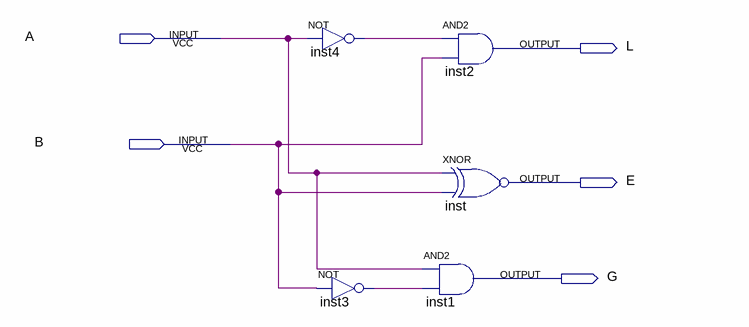
[diagram p0: schematic sheet]
// Quartus schematic comp_1bit.bdf as structural Verilog: 5 symbols, 5 pins
module comp_1bit (
  input  A,
  input  B,
  output L,
  output E,
  output G
);

  wire inst3_out, inst4_out;

  not inst4 (inst4_out, A);
  not inst3 (inst3_out, B);
  and inst2 (L, inst4_out, B);
  xnor inst (E, A, B);
  and inst1 (G, A, inst3_out);
endmodule
